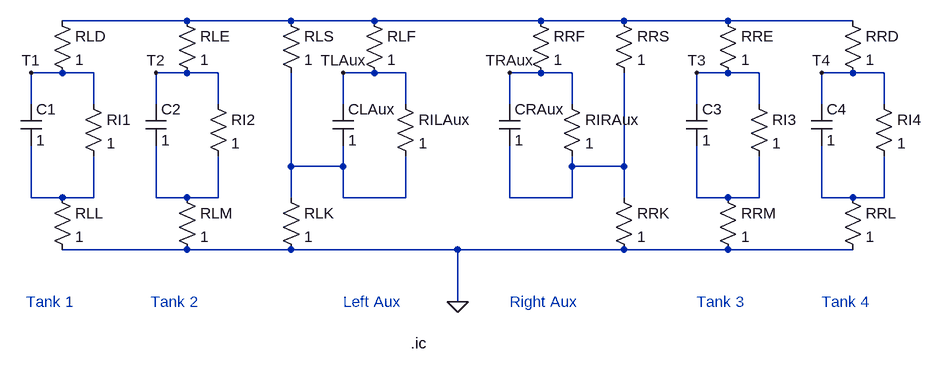
[diagram p0: schematic fuel_tanks.asc]
fuel_tanks.asc, the LTspice schematic file:
Version 4
SHEET 1 1300 680
WIRE 160 -16 -32 -16
WIRE 320 -16 160 -16
WIRE 448 -16 320 -16
WIRE 704 -16 448 -16
WIRE 832 -16 704 -16
WIRE 992 -16 832 -16
WIRE 1184 -16 992 -16
WIRE -32 64 -80 64
WIRE 16 64 -32 64
WIRE 160 64 112 64
WIRE 208 64 160 64
WIRE 448 64 400 64
WIRE 496 64 448 64
WIRE 704 64 656 64
WIRE 752 64 704 64
WIRE 992 64 944 64
WIRE 1040 64 992 64
WIRE 1184 64 1136 64
WIRE 1232 64 1184 64
WIRE -80 112 -80 64
WIRE 16 112 16 64
WIRE 112 112 112 64
WIRE 208 112 208 64
WIRE 400 112 400 64
WIRE 496 112 496 64
WIRE 656 112 656 64
WIRE 752 112 752 64
WIRE 944 112 944 64
WIRE 1040 112 1040 64
WIRE 1136 112 1136 64
WIRE 1232 112 1232 64
WIRE 320 208 320 64
WIRE 400 208 400 176
WIRE 400 208 320 208
WIRE 752 208 752 192
WIRE 832 208 832 64
WIRE 832 208 752 208
WIRE -80 256 -80 176
WIRE -32 256 -80 256
WIRE 16 256 16 192
WIRE 16 256 -32 256
WIRE 112 256 112 176
WIRE 160 256 112 256
WIRE 208 256 208 192
WIRE 208 256 160 256
WIRE 320 256 320 208
WIRE 400 256 400 208
WIRE 496 256 496 192
WIRE 496 256 400 256
WIRE 656 256 656 176
WIRE 752 256 752 208
WIRE 752 256 656 256
WIRE 832 256 832 208
WIRE 944 256 944 176
WIRE 992 256 944 256
WIRE 1040 256 1040 192
WIRE 1040 256 992 256
WIRE 1136 256 1136 176
WIRE 1184 256 1136 256
WIRE 1232 256 1232 192
WIRE 1232 256 1184 256
WIRE 160 336 -32 336
WIRE 320 336 160 336
WIRE 576 336 320 336
WIRE 832 336 576 336
WIRE 992 336 832 336
WIRE 1184 336 992 336
WIRE 576 416 576 336
FLAG -80 64 T1
FLAG 112 64 T2
FLAG 400 64 TLAux
FLAG 656 64 TRAux
FLAG 944 64 T3
FLAG 1136 64 T4
FLAG 576 416 0
SYMBOL cap -96 112 R0
SYMATTR InstName C1
SYMATTR Value 1
SYMBOL res 0 96 R0
SYMATTR InstName RI1
SYMATTR Value 1
SYMBOL res -48 -32 R0
SYMATTR InstName RLD
SYMATTR Value 1
SYMBOL res -48 240 R0
SYMATTR InstName RLL
SYMATTR Value 1
SYMBOL cap 96 112 R0
SYMATTR InstName C2
SYMATTR Value 1
SYMBOL res 192 96 R0
SYMATTR InstName RI2
SYMATTR Value 1
SYMBOL res 144 -32 R0
SYMATTR InstName RLE
SYMATTR Value 1
SYMBOL res 144 240 R0
SYMATTR InstName RLM
SYMATTR Value 1
SYMBOL cap 928 112 R0
SYMATTR InstName C3
SYMATTR Value 1
SYMBOL res 1024 96 R0
SYMATTR InstName RI3
SYMATTR Value 1
SYMBOL res 976 -32 R0
SYMATTR InstName RRE
SYMATTR Value 1
SYMBOL res 976 240 R0
SYMATTR InstName RRM
SYMATTR Value 1
SYMBOL cap 1120 112 R0
SYMATTR InstName C4
SYMATTR Value 1
SYMBOL res 1216 96 R0
SYMATTR InstName RI4
SYMATTR Value 1
SYMBOL res 1168 -32 R0
SYMATTR InstName RRD
SYMATTR Value 1
SYMBOL res 1168 240 R0
SYMATTR InstName RRL
SYMATTR Value 1
SYMBOL cap 384 112 R0
SYMATTR InstName CLAux
SYMATTR Value 1
SYMBOL res 480 96 R0
SYMATTR InstName RILAux
SYMATTR Value 1
SYMBOL res 432 -32 R0
SYMATTR InstName RLF
SYMATTR Value 1
SYMBOL cap 640 112 R0
SYMATTR InstName CRAux
SYMATTR Value 1
SYMBOL res 736 96 R0
SYMATTR InstName RIRAux
SYMATTR Value 1
SYMBOL res 688 -32 R0
SYMATTR InstName RRF
SYMATTR Value 1
SYMBOL res 304 -32 R0
SYMATTR InstName RLS
SYMATTR Value 1
SYMBOL res 304 240 R0
SYMATTR InstName RLK
SYMATTR Value 1
SYMBOL res 816 -32 R0
SYMATTR InstName RRS
SYMATTR Value 1
SYMBOL res 816 240 R0
SYMATTR InstName RRK
SYMATTR Value 1
TEXT -88 416 Left 2 ;Tank 1
TEXT 104 416 Left 2 ;Tank 2
TEXT 400 416 Left 2 ;Left Aux
TEXT 656 416 Left 2 ;Right Aux
TEXT 944 416 Left 2 ;Tank 3
TEXT 1136 416 Left 2 ;Tank 4
TEXT 504 480 Left 2 !.ic

The netlist it stands for:
* fuel_tanks.asc
C1 T1 N004 1
RI1 T1 N004 1
RLD N001 T1 1
RLL N004 0 1
C2 T2 N005 1
RI2 T2 N005 1
RLE N001 T2 1
RLM N005 0 1
C3 T3 N006 1
RI3 T3 N006 1
RRE N001 T3 1
RRM N006 0 1
C4 T4 N007 1
RI4 T4 N007 1
RRD N001 T4 1
RRL N007 0 1
CLAux TLAux N002 1
RILAux TLAux N002 1
RLF N001 TLAux 1
CRAux TRAux N003 1
RIRAux TRAux N003 1
RRF N001 TRAux 1
RLS N001 N002 1
RLK N002 0 1
RRS N001 N003 1
RRK N003 0 1
* Tank 1
* Tank 2
* Left Aux
* Right Aux
* Tank 3
* Tank 4
.ic
.backanno
.end